# Altium schematic sheet sdcard.SchDoc: SD CARD
size A4; SheetNumber: 16; SheetTotal: 17
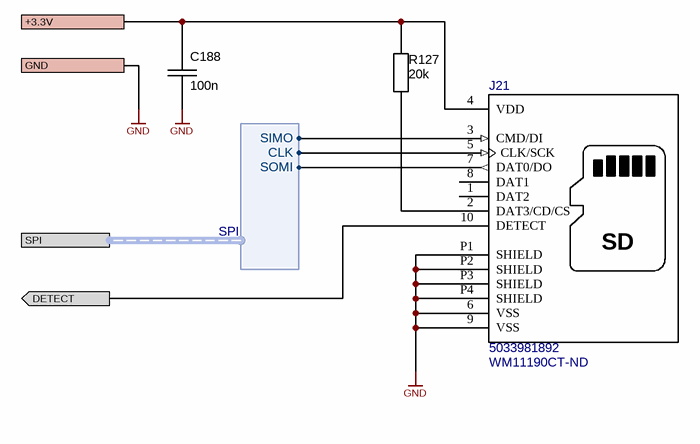
[diagram p0: sdcard.SchDoc]

## Parts
C188  100n  [SM/C0402]
J21  5033981892  Supplier Part Number 1: WM11190CT-ND  [MOLEX_503398-1892]
R127  20k  [SM/R0402]

## Ports
+3.3V, DETECT (out), GND, SPI (harness SPI)

## Harnesses
SPI: SIMO, SOMI, CLK

## Nets
GND: C188.2 J21.6(VSS) J21.9(VSS) J21.P1(SHIELD) J21.P2(SHIELD) J21.P3(SHIELD) J21.P4(SHIELD) ; port GND
+3.3V: C188.1 J21.4(VDD) R127.1 ; port +3.3V
DETECT: J21.10(DETECT) ; port DETECT
NetJ21_2: J21.2(DAT3/CD/CS) R127.2
NetJ21_3: J21.3(CMD/DI) ; port SPI.SIMO
NetJ21_5: J21.5(CLK/SCK) ; port SPI.CLK
NetJ21_7: J21.7(DAT0/DO) ; port SPI.SOMI

Not connected (* = marked no-connect by the designer): J21 1(DAT2) 8(DAT1)

## Notes on the sheet
- HES-SO / HEIG-VD / TIN / IAI
  Route de Cheseaux, 1
  CH-1401 Yverdon-les-Bains
  +41 24 557 73 77
  http://iai.heig-vd.ch
  iai@heig-vd.ch
- Title
- Format
- Date
- A4
- Project Name
- Author
- Project ID
- VCS
- Revision
- Page
- /
- File
- (in symbol CONN SD MOLEX 503398-1892) SD

## Library data of the parts
C188 = C: 0.1 µF ±10% 25V Ceramic Capacitor X5R 0402 (1005 Metric); Voltage: 25V; Dielectric: X5R; Supplier 1: Digi-Key; Supplier Part Number 1: 1276-1043-1-ND; Value: 100n
J21 = CONN SD MOLEX 503398-1892: Supplier 1: Digi-Key
R127 = R: 20 kOhms ±1% 0.063W, 1/16W Chip Resistor 0402 (1005 Metric) Moisture Resistant Thick Film; Supplier 1: Digi-Key; Supplier Part Number 1: 311-20.0KLRCT-ND; Value: 20k